# EAGLE design bue_steuerung_3 (EAGLE 7.6.0)
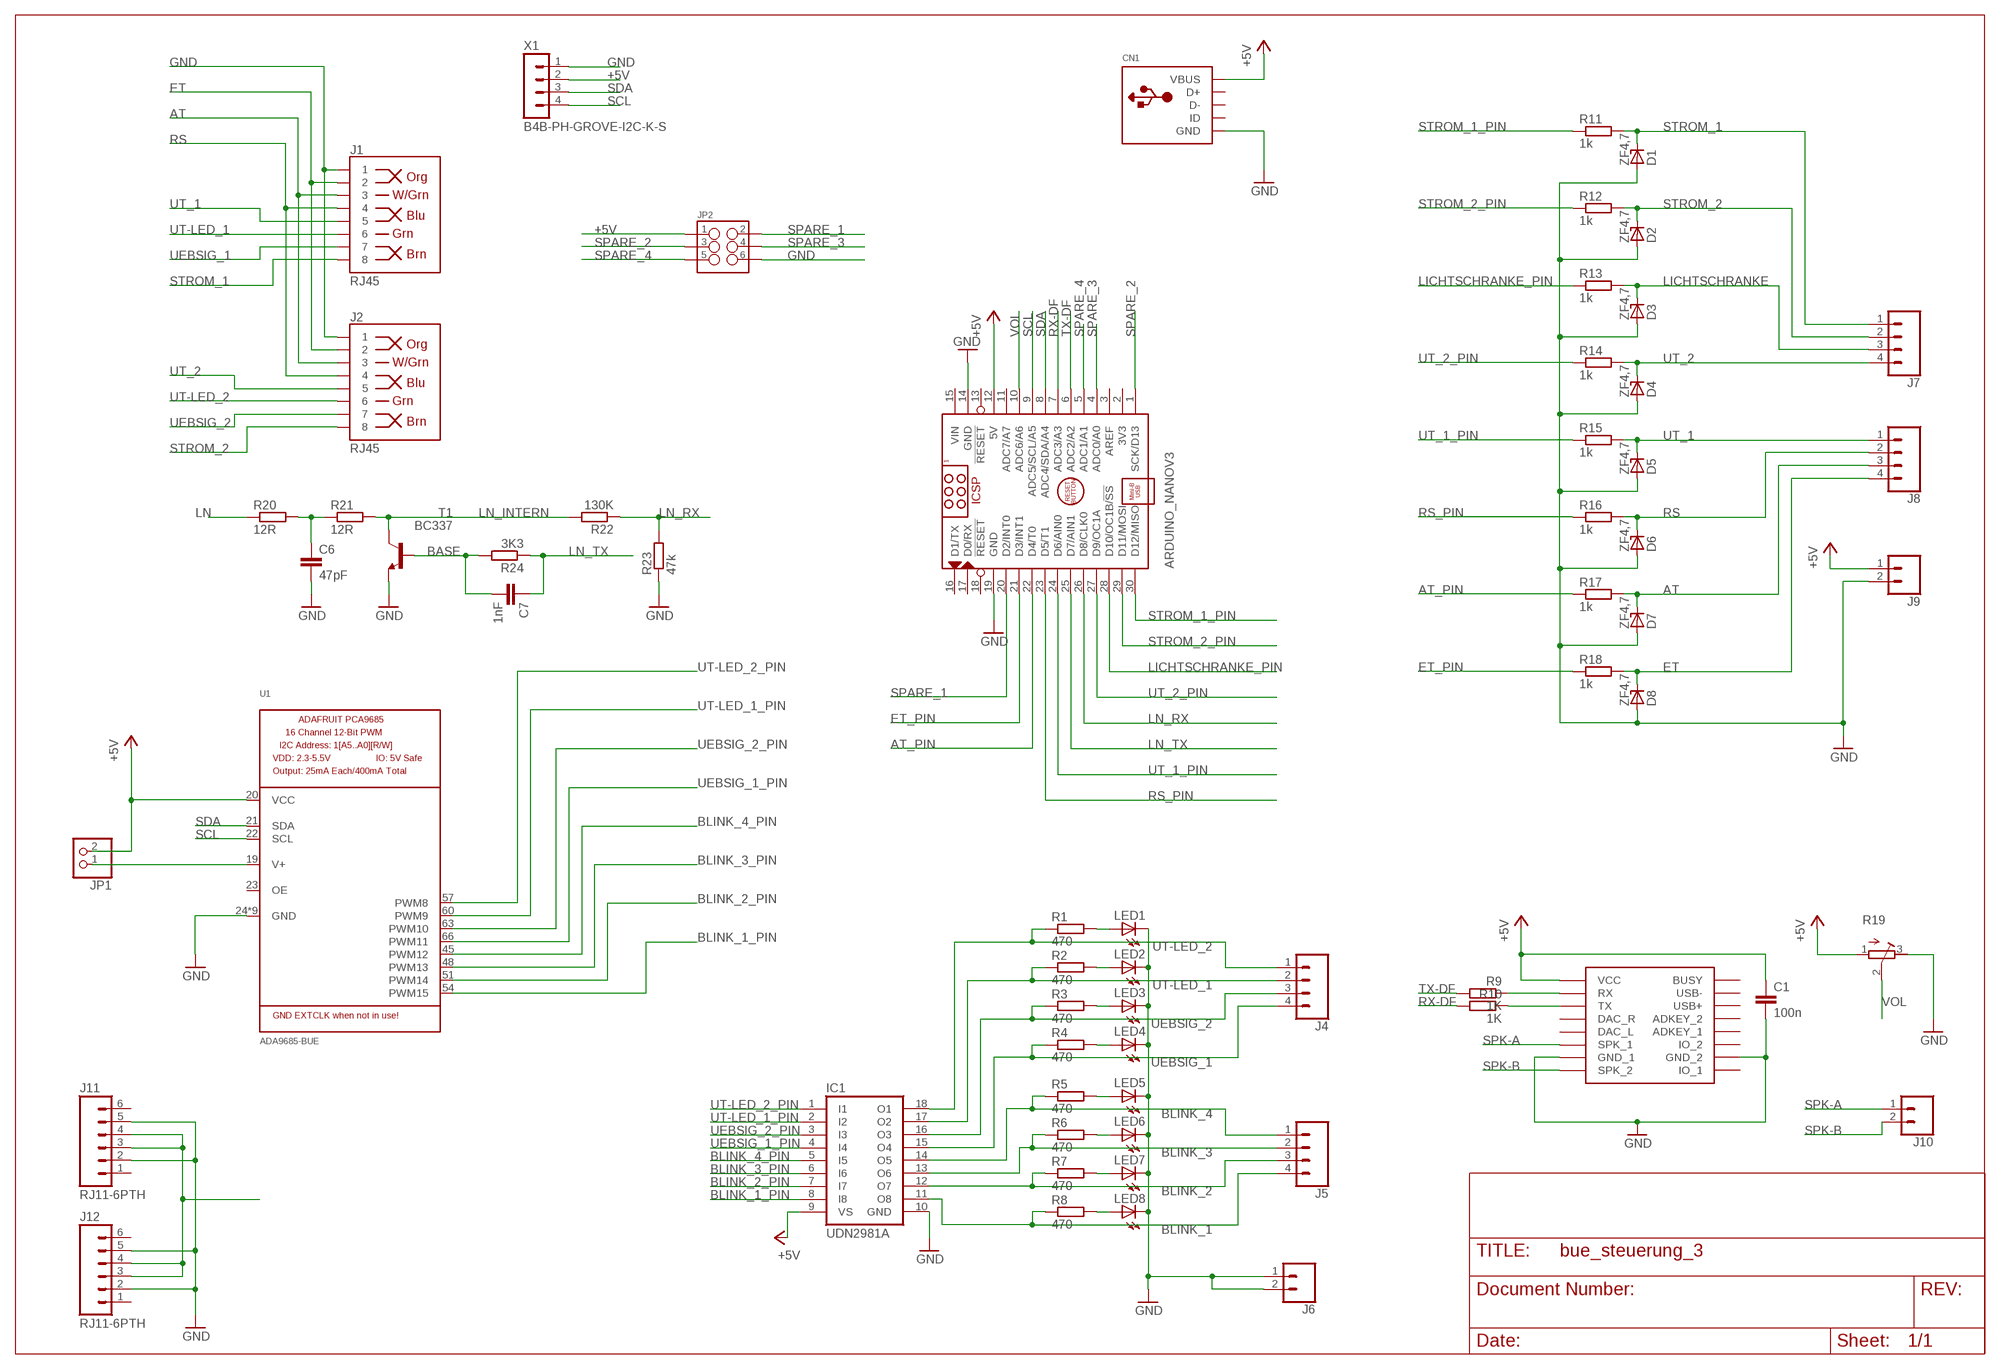
[diagram p0: schematic, sheet 1]

## Parts
ARDUINO_NANOV3  ARDUINO_NANO  [ARDUINO_NANO]
C1  100n  C-EUC0805  [C0805]
C6  47pF  C-EU025-024X044  [C025-024X044]
C7  1nF  C-EU025-025X050  [C025-025X050]
CN1  USBMOLEX  [USB-MINIB-THM-MOLEX]
D1  ZF4,7  ZENER-DIODEZD-7.5  [ZDIO-7.5]
D2  ZF4,7  ZENER-DIODEZD-7.5  [ZDIO-7.5]
D3  ZF4,7  ZENER-DIODEZD-7.5  [ZDIO-7.5]
D4  ZF4,7  ZENER-DIODEZD-7.5  [ZDIO-7.5]
D5  ZF4,7  ZENER-DIODEZD-7.5  [ZDIO-7.5]
D6  ZF4,7  ZENER-DIODEZD-7.5  [ZDIO-7.5]
D7  ZF4,7  ZENER-DIODEZD-7.5  [ZDIO-7.5]
D8  ZF4,7  ZENER-DIODEZD-7.5  [ZDIO-7.5]
IC1  UDN2981A  [DIL18]
J1  RJ45  RJ45-8  [RJ45-8]
J2  RJ45  RJ45-8  [RJ45-8]
J4  CONN_04SCREW  [SCREWTERMINAL-3.5MM-4]
J5  CONN_04SCREW  [SCREWTERMINAL-3.5MM-4]
J6  CONN_023.5MM  [SCREWTERMINAL-3.5MM-2]
J7  CONN_04SCREW  [SCREWTERMINAL-3.5MM-4]
J8  CONN_04SCREW  [SCREWTERMINAL-3.5MM-4]
J9  CONN_023.5MM  [SCREWTERMINAL-3.5MM-2]
J10  CONN_023.5MM  [SCREWTERMINAL-3.5MM-2]
J11  RJ11-6PTH  [RJ11-6]
J12  RJ11-6PTH  [RJ11-6]
JP1  PINHD-1X2  [1X02]
JP2  M03X2SHROUD  [2X3-SHROUDED]
LED1  LED3MM  [LED3MM]
LED2  LED3MM  [LED3MM]
LED3  LED3MM  [LED3MM]
LED4  LED3MM  [LED3MM]
LED5  LED3MM  [LED3MM]
LED6  LED3MM  [LED3MM]
LED7  LED3MM  [LED3MM]
LED8  LED3MM  [LED3MM]
R1  470  R-EU_0207/7  [0207/7]
R2  470  R-EU_0207/7  [0207/7]
R3  470  R-EU_0207/7  [0207/7]
R4  470  R-EU_0207/7  [0207/7]
R5  470  R-EU_0207/7  [0207/7]
R6  470  R-EU_0207/7  [0207/7]
R7  470  R-EU_0207/7  [0207/7]
R8  470  R-EU_0207/7  [0207/7]
R9  1K  R-EU_0207/7  [0207/7]
R10  1K  R-EU_0207/7  [0207/7]
R11  1k  R-EU_0207/7  [0207/7]
R12  1k  R-EU_0207/7  [0207/7]
R13  1k  R-EU_0207/7  [0207/7]
R14  1k  R-EU_0207/7  [0207/7]
R15  1k  R-EU_0207/7  [0207/7]
R16  1k  R-EU_0207/7  [0207/7]
R17  1k  R-EU_0207/7  [0207/7]
R18  1k  R-EU_0207/7  [0207/7]
R19  R-TRIMM64Y  [RTRIM64Y]
R20  12R  R-EU_0207/7  [0207/7]
R21  12R  R-EU_0207/7  [0207/7]
R22  130K  R-EU_0207/7  [0207/7]
R23  47k  R-EU_0207/7  [0207/7]
R24  3K3  R-EU_0207/7  [0207/7]
T1  BC337  [TO92]
U1  ADA9685-BUE  [ADA9685-BUE]
U2  DFPLAYER  [DFPLAYER]
X1  B4B-PH-GROVE-I2C-K-S  [B4B-PH-K-S]

## Nets
+5V: ARDUINO_NANOV3.12(5V) C1.1 CN1.VBUS IC1.9(VS) J9.1 JP1.2 JP2.1 R19.1(A) U1.20(VCC) U2.VCC X1.2
AT: D7.C J1.3 J2.3 J8.3 R17.2
AT_PIN: ARDUINO_NANOV3.22(D4/T0) R17.1
BASE: C7.2 R24.2 T1.2(B)
BLINK_1: IC1.11(O8) J5.4 R8.1
BLINK_1_PIN: IC1.8(I8) U1.54(PWM15)
BLINK_2: IC1.12(O7) J5.3 R7.1
BLINK_2_PIN: IC1.7(I7) U1.51(PWM14)
BLINK_3: IC1.13(O6) J5.2 R6.1
BLINK_3_PIN: IC1.6(I6) U1.48(PWM13)
BLINK_4: IC1.14(O5) J5.1 R5.1
BLINK_4_PIN: IC1.5(I5) U1.45(PWM12)
ET: D8.C J1.2 J2.2 J8.4 R18.2
ET_PIN: ARDUINO_NANOV3.21(D3/INT1) R18.1
GND: ARDUINO_NANOV3.14(GND) ARDUINO_NANOV3.19(GND) C1.2 C6.2 CN1.GND D1.A D2.A D3.A D4.A D5.A D6.A D7.A D8.A IC1.10(GND) J1.1 J2.1 J6.1 J6.2 J9.2 J11.2 J11.5 J12.2 J12.5 JP2.6 LED1.K(C) LED2.K(C) LED3.K(C) LED4.K(C) LED5.K(C) LED6.K(C) LED7.K(C) LED8.K(C) R19.3(E) R23.1 T1.1(E) U1.24(GND) U1.43(GND) U1.46(GND) U1.49(GND) U1.52(GND) U1.55(GND) U1.58(GND) U1.61(GND) U1.64(GND) U2.GND_1 U2.GND_2 X1.1
LICHTSCHRANKE: D3.C J7.3 R13.2
LICHTSCHRANKE_PIN: ARDUINO_NANOV3.28(D10/OC1B/!SS) R13.1
LN: J11.3 J11.4 J12.3 J12.4 R20.1
LN_INTERN: R21.2 R22.2 T1.3(C)
LN_RX: ARDUINO_NANOV3.26(D8/CLK0) R22.1 R23.2
LN_TX: ARDUINO_NANOV3.25(D7/AIN1) C7.1 R24.1
N$1: JP1.1 U1.19(V+)
N$6: LED4.A R4.2
N$7: C6.1 R20.2 R21.1
N$8: R9.1 U2.RX
N$10: R10.1 U2.TX
N$47: LED8.A R8.2
N$48: LED7.A R7.2
N$49: LED6.A R6.2
N$58: LED5.A R5.2
N$59: LED3.A R3.2
N$60: LED2.A R2.2
N$62: LED1.A R1.2
RS: D6.C J1.4 J2.4 J8.2 R16.2
RS_PIN: ARDUINO_NANOV3.23(D5/T1) R16.1
RX-DF: ARDUINO_NANOV3.7(ADC3/A3) R10.2
SCL: ARDUINO_NANOV3.9(ADC5/SCL/A5) U1.22(SCL) X1.4
SDA: ARDUINO_NANOV3.8(ADC4/SDA/A4) U1.21(SDA) X1.3
SPARE_1: ARDUINO_NANOV3.20(D2/INT0) JP2.2
SPARE_2: ARDUINO_NANOV3.1(SCK/D13) JP2.3
SPARE_3: ARDUINO_NANOV3.4(ADC0/A0) JP2.4
SPARE_4: ARDUINO_NANOV3.5(ADC1/A1) JP2.5
SPK-A: J10.1 U2.SPK1(SPK_1)
SPK-B: J10.2 U2.SPK2(SPK_2)
STROM_1: D1.C J1.8 J7.1 R11.2
STROM_1_PIN: ARDUINO_NANOV3.30(D12/MISO) R11.1
STROM_2: D2.C J2.8 J7.2 R12.2
STROM_2_PIN: ARDUINO_NANOV3.29(D11/MOSI) R12.1
TX-DF: ARDUINO_NANOV3.6(ADC2/A2) R9.2
UEBSIG_1: IC1.15(O4) J1.7 J4.4 R4.1
UEBSIG_1_PIN: IC1.4(I4) U1.66(PWM11)
UEBSIG_2: IC1.16(O3) J2.7 J4.3 R3.1
UEBSIG_2_PIN: IC1.3(I3) U1.63(PWM10)
UT-LED_1: IC1.17(O2) J1.6 J4.2 R2.1
UT-LED_1_PIN: IC1.2(I2) U1.60(PWM9)
UT-LED_2: IC1.18(O1) J2.6 J4.1 R1.1
UT-LED_2_PIN: IC1.1(I1) U1.57(PWM8)
UT_1: D5.C J1.5 J8.1 R15.2
UT_1_PIN: ARDUINO_NANOV3.24(D6/AIN0) R15.1
UT_2: D4.C J2.5 J7.4 R14.2
UT_2_PIN: ARDUINO_NANOV3.27(D9/OC1A) R14.1
VOL: ARDUINO_NANOV3.10(ADC6/A6) R19.2(S)
Unconnected: ARDUINO_NANOV3.2(3V3) ARDUINO_NANOV3.3(AREF) ARDUINO_NANOV3.11(ADC7/A7) ARDUINO_NANOV3.13(!RESET) ARDUINO_NANOV3.16(D1/TX) ARDUINO_NANOV3.17(D0/RX) ARDUINO_NANOV3.18(!RESET) CN1.D+ CN1.D- CN1.ID J11.1 J11.6 J12.1 J12.6 U1.23(OE) U2.ADKEY1(ADKEY_1) U2.ADKEY2(ADKEY_2) U2.BUSY U2.DAC_L U2.DAC_R U2.IO1(IO_1) U2.IO2(IO_2) U2.USB+ U2.USB-

## Power pins joined to a net without a drawn wire
VIN: ARDUINO_NANOV3.15(VIN)

## Library data of the parts
ARDUINO_NANOV3 = ArduinoNanoV30:ARDUINO_NANO: Arduino Nano V3.0 Module Overview: The Arduino Nano is a small, complete, and breadboard-friendly board based on the ATmega328 (Arduino Nano 3.x) or ATmega168 (Arduino Nano 2.x). It has more or less the same functionality of the Arduino Duemilanove, but in a different package. It lacks only a DC power jack, and works with a Mini-B USB cable instead of a standard one. The Nano was designed and is being produced by Gravitech <http://www.gravitech.us/arna30wiatp.html>. General specifications: Item Value Microcontroller Atmel ATmega168 or ATmega328 Operating Voltage (logic level) 5 V Input Voltage (recommended) 7-12 V Input Voltage (limits) 6-20 V Digital I/O Pins 14 (of which 6 provide PWM output) Analog Input Pins 8 DC Current per I/O Pin 40 mA Flash Memory 16 KB (ATmega168) or 32 KB (ATmega328) of which 2 KB used by bootloader SRAM 1 KB (ATmega168) or 2 KB (ATmega328) EEPROM 512 bytes (ATmega168) or 1 KB (ATmega328) Clock Speed 16 MHz Dimensions (Inches) 0.73" x 1.70" Dimensions (mm) 18mm x 45mm Overall height About 9 mm (not including pins) Weigth 5 g Power: The Arduino Nano can be powered via the Mini-B USB connection, 6-20V unregulated external power supply (pin 30), or 5V regulated external power supply (pin 27). The power source is automatically selected to the highest voltage source. Memory: The ATmega168 has 16 KB of flash memory for storing code (of which 2 KB is used for the bootloader); the ATmega328 has 32 KB, (also with 2 KB used for the bootloader). The ATmega168 has 1 KB of SRAM and 512 bytes of EEPROM (which can be read and written with the EEPROM library); the ATmega328 has 2 KB of SRAM and 1 KB of EEPROM. Input and Output: Each of the 14 digital pins on the Nano can be used as an input or output, using pinMode(), digitalWrite(), and digitalRead() functions. They operate at 5 volts. Each pin can provide or receive a maximum of 40 mA and has an internal pull-up resistor (disconnected by default) of 20-50 kOhms. In addition, some pins have specialized functions. Visit Arduino - ArduinoBoardNano <https://www.arduino.cc/en/Main/ArduinoBoardNano>
C1 C6 C7 = resistor:C-EU: CAPACITOR, European symbol
CN1 = adafruit:USB: USB Connectors USBMINIB - Surface Mount Female Mini-B USB Connector 4UConnector: 06564 By microbuilder.eu Thru-hole RA Female Mini-B USB Connector 4UConnector: 18732 By ladyada.net
D1-D8 = diode:ZENER-DIODE: Z-Diode
IC1 = uln-udn:UDN298*: DRIVER ARRAY Source: Allegro Microsystems Inc. / UDN2981-UDN2984.pdf
J1 J2 = SparkFun-Connectors:RJ45-8: RJ45 Jack - 8 pin Simple RJ45, 8-pin connection. Commonly used for Cat5, Cat5e, and Cat6 Ethernet cables. Here is the connector we sell at SparkFun: RJ45 8-Pin Connector <https://www.sparkfun.com/products/643> (PRT-00643) Datasheet <https://cdn.sparkfun.com/datasheets/Prototyping/04908.pdf> It is used on this SparkFun product: SparkFun RJ45 Breakout <https://www.sparkfun.com/products/716> (BOB-00716) Note, you may also be interested in the "MAGJACK" version of this. It is basically a RJ45 connector, but also has some status LEDs built into the connector housing. You can check that out in this library at the device named "MAGJACK.dev" and see these products online: RJ45 Ethernet MagJack-Compatible <https://www.sparkfun.com/products/8534> (PRT-08534) SparkFun RJ45 MagJack Breakout <https://www.sparkfun.com/products/13021> (BOB-13021); PROD_ID: CONN-08506; SF_ID: PRT-00643
J4 J5 J7 J8 = SparkFun-Connectors:CONN_04: Multi connection point. Often used as Generic Header-pin footprint for 0.1 inch spaced/style header connections On any of the 0.1 inch spaced packages, you can populate with these: Break Away Headers - Straight <https://www.sparkfun.com/products/116> (PRT-00116) Break Away Male Headers - Right Angle <https://www.sparkfun.com/products/553> (PRT-00553) Female Headers <https://www.sparkfun.com/products/115> (PRT-00115) Break Away Headers - Machine Pin <https://www.sparkfun.com/products/117> (PRT-00117) Break Away Female Headers - Swiss Machine Pin <https://www.sparkfun.com/products/743> (PRT-00743) For SCREWTERMINALS and SPRING TERMINALS visit here: Screw Terimnals on SparkFun.com <https://www.sparkfun.com/search/results?term=Screw+Terminals> (5mm/3.5mm/2.54mm spacing) This device is also useful as a general connection point to wire up your design to another part of your project. Our various solder wires solder well into these plated through hole pads. Hook-Up Wire - Assortment (Stranded, 22 AWG) <https://www.sparkfun.com/products/11375> (PRT-11375) Hook-Up Wire - Assortment (Solid Core, 22 AWG) <https://www.sparkfun.com/products/11367> (PRT-11367) View the entire wire category on our website here <https://www.sparkfun.com/categories/141> Special notes: Molex polarized connector foot print use with SKU : PRT-08231 with associated crimp pins and housings. 1MM SMD Version SKU: PRT-10208; PROD_ID: 2xCONN-08399; SF_ID: 2xPRT-08084
J6 J9 J10 = SparkFun-Connectors:CONN_02: Multi connection point. Often used as Generic Header-pin footprint for 0.1 inch spaced/style header connections On any of the 0.1 inch spaced packages, you can populate with these: Break Away Headers - Straight <https://www.sparkfun.com/products/116> (PRT-00116) Break Away Male Headers - Right Angle <https://www.sparkfun.com/products/553> (PRT-00553) Female Headers <https://www.sparkfun.com/products/115> (PRT-00115) Break Away Headers - Machine Pin <https://www.sparkfun.com/products/117> (PRT-00117) Break Away Female Headers - Swiss Machine Pin <https://www.sparkfun.com/products/743> (PRT-00743) For SCREWTERMINALS and SPRING TERMINALS visit here: Screw Terimnals on SparkFun.com <https://www.sparkfun.com/search/results?term=Screw+Terminals> (5mm/3.5mm/2.54mm spacing) This device is also useful as a general connection point to wire up your design to another part of your project. Our various solder wires solder well into these plated through hole pads. Hook-Up Wire - Assortment (Stranded, 22 AWG) <https://www.sparkfun.com/products/11375> (PRT-11375) Hook-Up Wire - Assortment (Solid Core, 22 AWG) <https://www.sparkfun.com/products/11367> (PRT-11367) View the entire wire category on our website here <https://www.sparkfun.com/categories/141> Special notes: Molex polarized connector foot print use with: PRT-08233 with associated crimp pins and housings. 2.54_SCREWTERM for use with PRT-10571. 3.5mm Screw Terminal footprints for PRT-08084 5mm Screw Terminal footprints for use with PRT-08432; PROD_ID: CONN-08399
J11 J12 = SparkFun-Connectors:RJ11-6: RJ11 Jack Simple 6 pin RJ11 jack. Commonly found on CAT3 devices and Microchip programmers. SKU: PRT-00132
JP1 = pinhead:PINHD-1X2: PIN HEADER
JP2 = SparkFun-Connectors:M03X2: 2x3 .1" header. Shrouded, with keying- CONN-10681 SMT- CONN-11415 Pogo pins- HW-11044; PROD_ID: CONN-10681
LED1-LED8 = adafruit:LED: LED OSRAM: - CHIPLED LG R971, LG N971, LY N971, LG Q971, LY Q971, LO R971, LY R971 LH N974, LH R974 LS Q976, LO Q976, LY Q976 LO Q996 - Hyper CHIPLED LW Q18S LB Q993, LB Q99A, LB R99A - SideLED LS A670, LO A670, LY A670, LG A670, LP A670 LB A673, LV A673, LT A673, LW A673 LH A674 LY A675 LS A676, LA A676, LO A676, LY A676, LW A676 LS A679, LY A679, LG A679 - Hyper Micro SIDELED® LS Y876, LA Y876, LO Y876, LY Y876 LT Y87S - SmartLED LW L88C, LW L88S LB L89C, LB L89S, LG L890 LS L89K, LO L89K, LY L89K LS L896, LA L896, LO L896, LY L896 - TOPLED LS T670, LO T670, LY T670, LG T670, LP T670 LSG T670, LSP T670, LSY T670, LOP T670, LYG T670 LG T671, LOG T671, LSG T671 LB T673, LV T673, LT T673, LW T673 LH T674 LS T676, LA T676, LO T676, LY T676, LB T676, LH T676, LSB T676, LW T676 LB T67C, LV T67C, LT T67C, LS T67K, LO T67K, LY T67K, LW E67C LS E67B, LA E67B, LO E67B, LY E67B, LB E67C, LV E67C, LT E67C LW T67C LS T679, LY T679, LG T679 LS T770, LO T770, LY T770, LG T770, LP T770 LB T773, LV T773, LT T773, LW T773 LH T774 LS E675, LA E675, LY E675, LS T675 LS T776, LA T776, LO T776, LY T776, LB T776 LHGB T686 LT T68C, LB T68C - Hyper Mini TOPLED® LB M676 - Mini TOPLED Santana® LG M470 LS M47K, LO M47K, LY M47K Source: http://www.osram.convergy.de/
R1-R8 R11-R18 = resistor@1:R-EU_: RESISTOR, European symbol
R9 R10 R20-R24 = resistor:R-EU_: RESISTOR, European symbol
R19 = resistor@1:R-TRIMM: Trimm resistor
T1 = transistor:BC337: NPN TRANSISTOR
U1 = bue-parts:ADA9685-BUE
U2 = DFPlayer_v1:DFPLAYER
X1 = bue-parts:B4B-PH-GROVE-I2C: JST PH series header 2.00mm pitch disconnectable crimp style connectors, vertical (side entry type), 4 pins

## Board
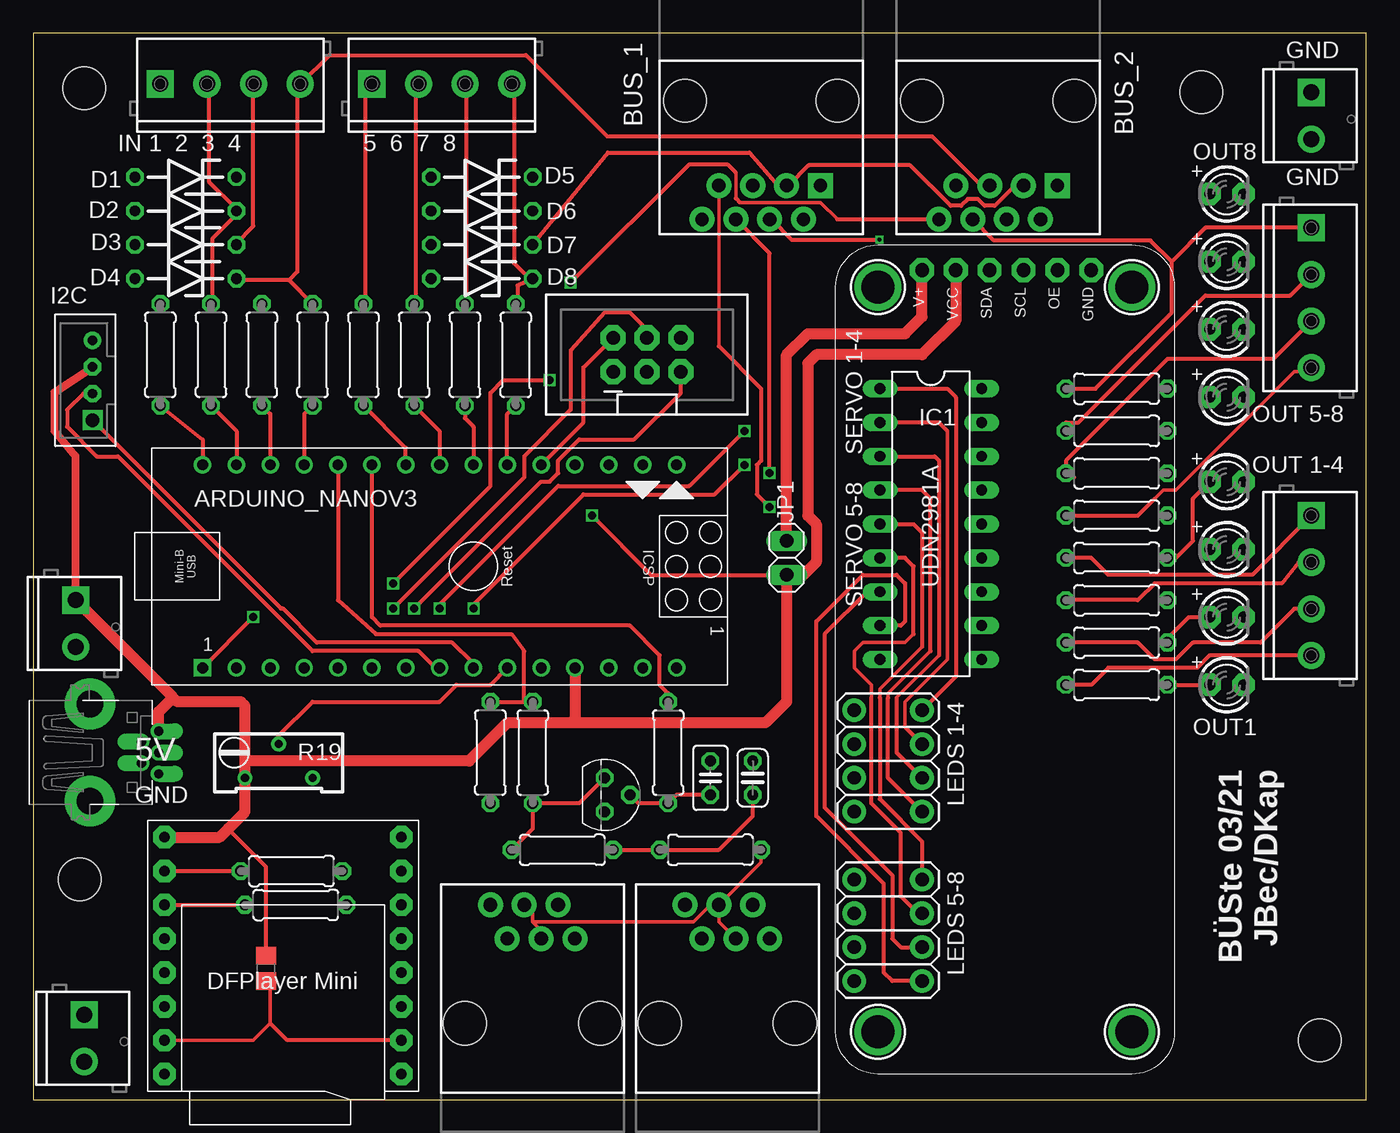
[diagram p1: board, top side]
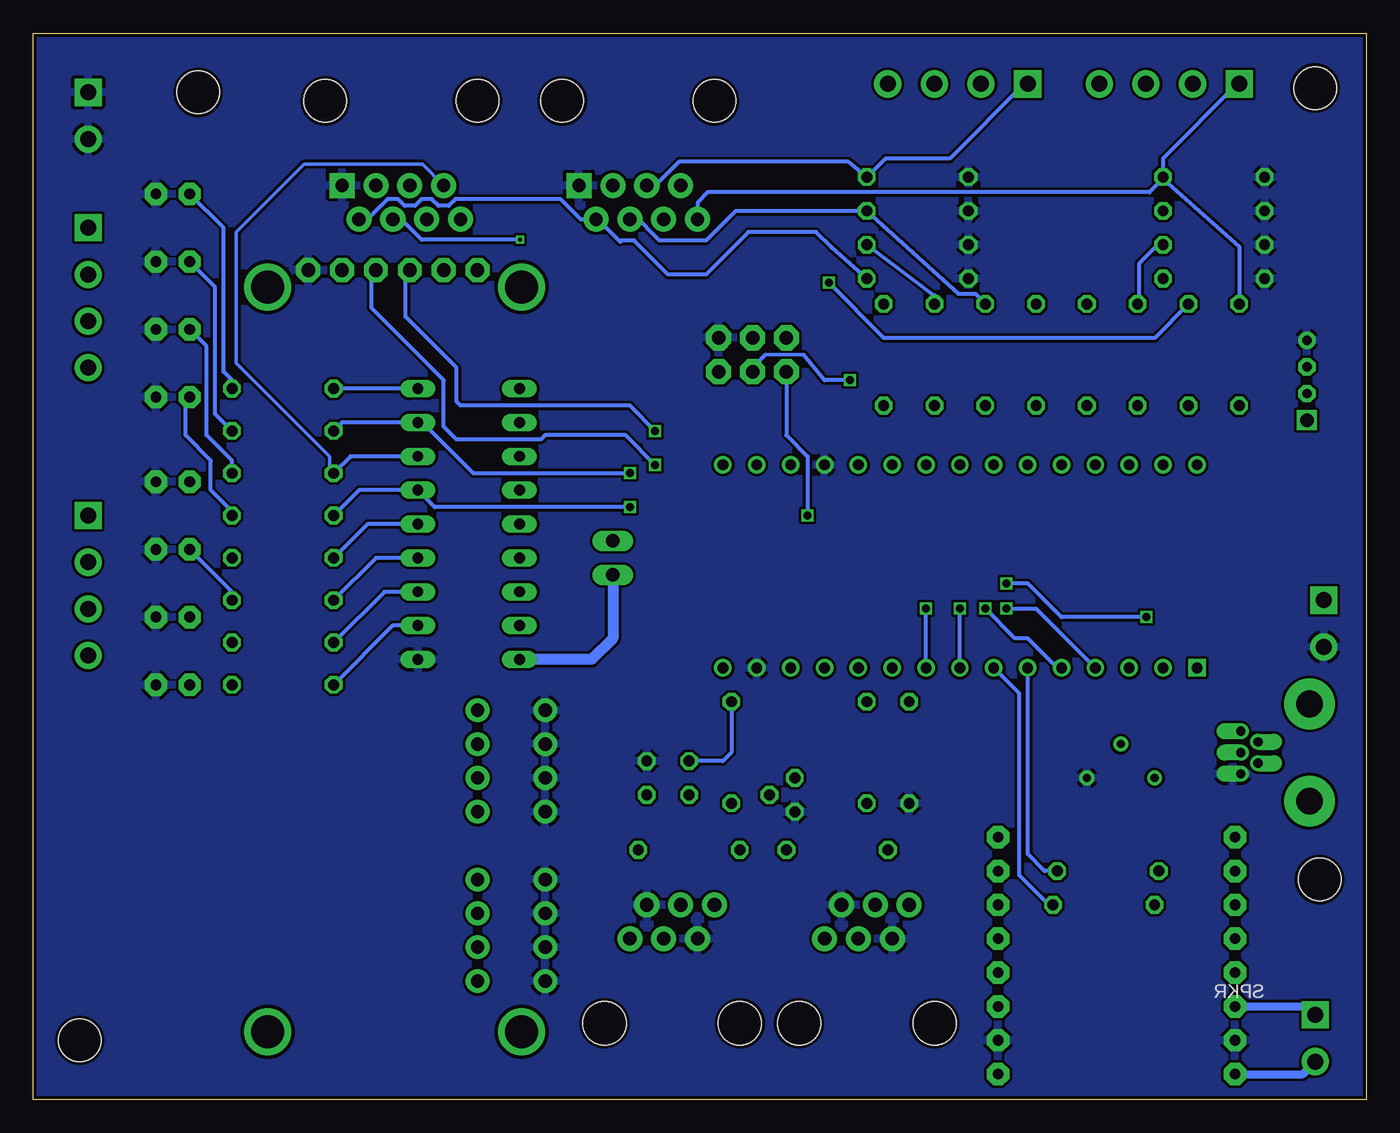
[diagram p2: board, bottom side, seen from below]

Size 100 x 80 mm. Coordinates in mm from the lower left corner, seen from the top.
Outline: 0,0 100,0 100,80 0,80 0,0
Copper layers (1*16): Top 0.035mm / dielectric 1.5mm / Bottom 0.035mm
Design rules "ITEADstudio_DRC_smaller_pad_restrings *": minimum track width 12mil, minimum drill 12mil, track to track 8mil, track to pad 8mil, pad to pad 8mil, via to via 8mil, smd to smd 0mil, copper to edge 10mil, drill to drill 10mil, minimum pad ring 10mil, minimum via ring 6mil, stop-mask expansion 2mil, vias tented up to drill 100mil, thermal gap 10mil
Holes 3.2 mm at 87.63,75.56 3.49,16.51 3.84,75.9 96.52,4.45

### Footprints (pad centres in the part's own frame; a part is rotated, then mirrored left to right if it is on the bottom)
ARDUINO_NANO = drill 0.8 square: 1 -20.32,-7.62 | drill 0.8: 2 -17.78,-7.62; 3 -15.24,-7.62; 4 -12.7,-7.62; 5 -10.16,-7.62; 6 -7.62,-7.62; 7 -5.08,-7.62; 8 -2.54,-7.62; 9 0,-7.62; 10 2.54,-7.62; 11 5.08,-7.62; 12 7.62,-7.62; 13 10.16,-7.62; 14 12.7,-7.62; 15 15.24,-7.62; 16 15.24,7.62; 17 12.7,7.62; 18 10.16,7.62; 19 7.62,7.62; 20 5.08,7.62; 21 2.54,7.62; 22 0,7.62; 23 -2.54,7.62; 24 -5.08,7.62; 25 -7.62,7.62; 26 -10.16,7.62; 27 -12.7,7.62; 28 -15.24,7.62; 29 -17.78,7.62; 30 -20.32,7.62
C0805 = smd 1.3 x 1.5: 1 -0.95,0; 2 0.95,0
C025-024X044 = drill 0.813 octagon: 1 -1.27,0; 2 1.27,0
C025-025X050 = drill 0.813 octagon: 1 -1.27,0; 2 1.27,0
USB-MINIB-THM-MOLEX = drill 0.7 offset: D+ 0,9.72; D- -0.8,8.42; GND 1.6,9.72; ID 0.8,8.42; VBUS -1.6,9.72 | drill 2 pad 3.81: GND1 -3.65,4.57; GND4 3.65,4.57
ZDIO-7.5 = drill 0.813 octagon: A 3.81,0; C -3.81,0
DIL18 = drill 0.813 long: 1 -10.16,-3.81; 2 -7.62,-3.81; 3 -5.08,-3.81; 4 -2.54,-3.81; 5 0,-3.81; 6 2.54,-3.81; 7 5.08,-3.81; 8 7.62,-3.81; 9 10.16,-3.81; 10 10.16,3.81; 11 7.62,3.81; 12 5.08,3.81; 13 2.54,3.81; 14 0,3.81; 15 -2.54,3.81; 16 -5.08,3.81; 17 -7.62,3.81; 18 -10.16,3.81
RJ45-8 = drill 1 pad 1.88 square: 1 -4.445,6.35 | drill 1 pad 1.88: 2 -3.175,8.89; 3 -1.905,6.35; 4 -0.635,8.89; 5 0.635,6.35; 6 1.905,8.89; 7 3.175,6.35; 8 4.445,8.89 | hole 3.2: -5.715,0; 5.715,0
SCREWTERMINAL-3.5MM-4 = drill 1.2 pad 2.032 square: 1 0,0 | drill 1.2 pad 2.032: 2 3.5,0; 3 7,0; 4 10.5,0
SCREWTERMINAL-3.5MM-2 = drill 1.2 pad 2.032 square: 1 0,0 | drill 1.2 pad 2.032: 2 3.5,0
RJ11-6 = drill 1.016 pad 1.88: 1 1.905,8.89; 2 3.175,6.35; 3 4.445,8.89; 4 5.715,6.35; 5 6.985,8.89; 6 8.255,6.35 | hole 3.251: 0,0; 10.16,0
1X02 = drill 1.016 long: 1 -1.27,0; 2 1.27,0
2X3-SHROUDED = drill 1.016 pad 1.88 octagon: 1 -1.27,2.54; 2 1.27,2.54; 3 -1.27,0; 4 1.27,0; 5 -1.27,-2.54; 6 1.27,-2.54
LED3MM = drill 0.813 pad 1.676 octagon: A -1.27,0; K 1.27,0
0207/7 = drill 0.813 octagon: 1 -3.81,0; 2 3.81,0
RTRIM64Y = drill 0.61: 1 0,-2.54; 2 -2.54,0; 3 0,2.54
TO92 = drill 0.813 octagon: 1 1.27,0; 2 0,1.905; 3 -1.27,0
ADA9685-BUE = drill 1.016 pad 1.778 octagon: 19 0,0; 20 0,2.54; 21 0,5.08; 22 0,7.62; 23 0,10.16; 24 0,12.7 | drill 1 pad 1.778: 43 45.72,-5.08; 45 45.72,0; 46 48.26,-5.08; 48 48.26,0; 49 50.8,-5.08; 51 50.8,0; 52 53.34,-5.08; 54 53.34,0; 55 33.02,-5.08; 57 33.02,0; 58 35.56,-5.08; 60 35.56,0; 61 38.1,-5.08; 63 38.1,0; 64 40.64,-5.08; 66 40.64,0 | drill 2.5 pad 3.2: P$1 1.27,-3.302; P$2 1.27,15.748; P$3 57.15,-3.302; P$4 57.15,15.748
DFPLAYER = drill 0.8 pad 1.676 octagon: ADKEY1 8.89,-1.27; ADKEY2 8.89,1.27; BUSY 8.89,8.89; DAC_L -8.89,-1.27; DAC_R -8.89,1.27; GND_1 -8.89,-6.35; GND_2 8.89,-6.35; IO1 8.89,-8.89; IO2 8.89,-3.81; RX -8.89,6.35; SPK1 -8.89,-3.81; SPK2 -8.89,-8.89; TX -8.89,3.81; USB+ 8.89,3.81; USB- 8.89,6.35; VCC -8.89,8.89
B4B-PH-K-S = drill 0.7 pad 1.3: 1 3,0 | drill 0.7 pad 1.3 octagon: 2 1,0; 3 -1,0 | drill 1 pad 1.3 square: 4 -3,0

### Placement (x,y rotation side)
ARDUINO_NANOV3  33.02,40.01 0 top
C1  17.46,9.84 270 top
C6  53.98,24.13 90 top
C7  50.8,24.13 270 top
CN1  -0.32,26.04 270 top
D1  11.43,69.22 180 top
D2  11.43,66.67 180 top
D3  11.43,64.14 180 top
D4  11.43,61.59 180 top
D5  33.66,69.22 180 top
D6  33.66,66.67 180 top
D7  33.66,64.14 180 top
D8  33.66,61.59 180 top
IC1  67.34,43.18 270 top
J1  54.61,74.93 180 top
J2  72.39,74.93 180 top
J4  95.89,65.41 270 top
J5  95.89,43.81 270 top
J6  95.89,75.56 270 top
J7  9.53,76.2 0 top
J8  25.4,76.2 0 top
J9  3.17,37.47 270 top
J10  3.81,6.35 270 top
J11  46.99,5.71 0 top
J12  32.38,5.71 0 top
JP1  56.52,40.64 270 top
JP2  46.04,55.88 90 top
LED1  89.53,67.94 0 top
LED2  89.53,62.87 0 top
LED3  89.53,57.78 0 top
LED4  89.53,52.7 0 top
LED5  89.53,46.35 0 top
LED6  89.53,41.27 0 top
LED7  89.53,36.2 0 top
LED8  89.53,31.11 0 top
R1  81.28,53.34 0 top
R2  81.28,50.16 0 top
R3  81.28,46.99 0 top
R4  81.28,43.81 0 top
R5  81.28,40.64 0 top
R6  81.28,37.47 0 top
R7  81.28,34.29 0 top
R8  81.28,31.11 0 top
R9  19.37,17.14 0 top
R10  19.68,14.61 0 top
R11  9.53,55.88 90 top
R12  13.34,55.88 90 top
R13  17.14,55.88 90 top
R14  20.95,55.88 90 top
R15  24.77,55.88 90 top
R16  28.57,55.88 90 top
R17  32.38,55.88 90 top
R18  36.2,55.88 90 top
R19  18.41,24.13 270 top
R20  50.8,18.73 180 top
R21  39.69,18.73 180 top
R22  37.47,26.04 270 top
R23  34.29,26.04 90 top
R24  47.62,26.04 270 top
T1  42.86,22.86 270 top
U1  66.67,62.23 270 top
U2  18.73,10.79 0 top
X1  4.45,53.98 90 top

### Tracks (layer width: path | path; a pad name or v marks a point on that pad's centre or on a via)
+5V  (via drill 0.6)
  Top 0.305: C1.1 17.46,17.46 14.61,20.32 | v41.91,43.81 46.35,39.37 JP1.2
  Top 0.61: J9.1 3.17,48.26 1.59,50.16 1.59,53.07 X1.2
  Top 0.813: 10.48,30.16 10.79,29.84 15.56,29.84 15.88,29.53 15.88,25.4 | 10.48,30.16 J9.1 | CN1.VBUS 9.4,29.09 10.48,30.16 | U1.20 69.22,58.42 66.67,55.88 58.74,55.88 58.1,55.24 58.1,43.81 58.74,43.18 58.74,40.32 57.78,39.37 JP1.2 56.52,29.84 54.93,28.26 40.32,28.26 | U2.VCC 13.97,19.68 14.61,20.32 15.88,21.59 R19.1 15.88,25.4 | ARDUINO_NANOV3.12 40.64,28.57 40.32,28.26 | 40.32,28.26 35.56,28.26 32.7,25.4 15.88,25.4
  Bottom 0.305: JP2.1 43.5,49.85 41.91,48.26 v41.91,43.81
  Bottom 0.813: JP1.2 56.52,34.61 58.1,33.02 IC1.9
AT
  Top 0.305: R17.2 32.51,59.82 32.51,76.2 J8.3 | D7.C 43.12,71.06 53.72,71.06 55.88,68.58 J1.3 56.64,68.58 58.17,70.1 65.79,70.1 68.83,67.06 69.6,67.06 70.1,67.56 70.87,67.56 71.37,67.06 72.14,67.06 73.66,68.58 J2.3
  Bottom 0.305: D7.C 32.38,60.33 R17.2
AT_PIN
  Top 0.305: R17.1 32.38,51.12 33.02,50.48 ARDUINO_NANOV3.22
BASE
  Top 0.305: T1.2 45.4,22.23 R24.2 48.26,22.86 C7.2
BLINK_1
  Top 0.305: J5.4 88.24,33.31 87.31,32.38 80.64,32.38 79.38,31.11 R8.1
  Bottom 0.305: IC1.11 73.03,35.56 R8.1
BLINK_1_PIN
  Top 0.305: U1.54 64.45,8.89 63.82,9.53 63.82,16.19 58.74,21.27 58.74,35.88 62.23,39.37 64.77,39.37 65.41,38.73 65.41,35.88 65.09,35.56 IC1.8
BLINK_2
  Top 0.305: J5.3 94.6,36.81 92.08,34.29 87,34.29 85.72,33.02 84.14,33.02 82.87,34.29 R7.1
  Bottom 0.305: IC1.12 73.66,38.1 R7.1
BLINK_2_PIN
  Top 0.305: IC1.7 62.55,38.1 59.37,34.92 59.37,21.91 64.45,16.83 64.45,12.06 65.09,11.43 U1.51
BLINK_3
  Top 0.305: J5.2 94.92,40.31 93.66,38.73 84.14,38.73 82.87,37.47 R6.1
  Bottom 0.305: IC1.13 74.3,40.64 R6.1
BLINK_3_PIN
  Top 0.254: 62.87,30.16 62.87,31.11 61.59,32.38 61.59,33.66 62.23,34.29 65.41,34.29 66.04,34.92
  Top 0.305: 66.04,34.92 66.04,40.01 65.41,40.64 IC1.6 | U1.48 66.36,13.97 65.09,15.24 65.09,20 62.87,22.23 62.87,30.16
BLINK_4
  Top 0.305: J5.1 91.44,39.37 80.64,39.37 79.38,40.64 R5.1
  Bottom 0.305: IC1.14 74.93,43.18 R5.1
BLINK_4_PIN
  Top 0.254: 63.5,30.16 63.5,30.8 66.67,33.97
  Top 0.305: IC1.5 66.04,43.18 66.67,42.55 66.67,33.97 | 63.5,30.16 63.5,22.54 66.67,19.37 U1.45
ET
  Top 0.305: R18.2 36.32,59.82 36.32,61.09 D8.C 37.34,61.72 37.34,61.47 36.07,62.74 36.07,76.2 J8.4
  Bottom 0.305: D8.C 40.13,63.94 41.27,65.09 46.35,65.09 49.53,61.91 52.39,61.91 54.93,64.45 55.88,64.45 55.98,64.36 57.66,66.04 J1.2 58.93,66.04 60.45,67.56 68.33,67.56 68.83,67.06 69.6,67.06 70.1,67.56 70.87,67.56 71.37,67.06 72.14,67.06 72.64,67.56 73.41,67.56 74.93,66.04 J2.2
ET_PIN
  Top 0.305: ARDUINO_NANOV3.21 35.56,51.44 R18.1
GND
  Top 0.254: U2.GND_1 16.51,4.45 17.78,5.71 17.78,8.57 C1.2
  Top 0.305: U2.GND_2 19.05,4.45 17.78,5.71
  pour Bottom: 0,80.01 100.33,80.01 100.33,0 0,0
LICHTSCHRANKE
  Top 0.305: D3.C 15.24,64.26 16.51,65.53 J7.3
  Bottom 0.305: D3.C 15.24,64.52 17.02,62.74 17.02,59.69 R13.2
LICHTSCHRANKE_PIN
  Top 0.305: ARDUINO_NANOV3.28 17.78,51.44 R13.1
LN
  Top 0.254: R20.1 54.61,17.78 J11.3 | J11.3 51.44,13.34 J11.4 | J11.3 50.8,14.61 49.53,13.34 37.47,13.34 | 37.47,13.34 37.47,13.97 J12.3 | J12.4 38.1,12.7 37.47,13.34
LN_INTERN
  Top 0.305: T1.3 40.96,22.23 R22.2 37.47,20.32 R21.2
LN_RX
  Top 0.305: R22.1 36.83,29.84 | R23.2 36.83,29.84 | 36.83,29.84 36.83,33.66 35.88,34.92 25.72,34.92 22.86,37.47 ARDUINO_NANOV3.26
LN_TX
  Top 0.305: R24.1 47.62,30.48 46.99,31.11 46.99,33.34 44.77,35.56 26.04,35.56 25.4,36.2 ARDUINO_NANOV3.25
  Bottom 0.305: R24.1 47.62,26.04 48.26,25.4 C7.1
N$1
  Top 0.813: JP1.1 56.52,55.88 58.1,57.47 65.41,57.47 66.67,58.74 U1.19
N$6
  Bottom 0.305: R4.2 85.09,44.13 86.68,45.72 86.68,47.94 88.58,49.85 88.58,52.39 LED4.A
N$7
  Top 0.305: R21.1 R20.2 51.44,18.73 53.98,21.27 C6.1
N$8
  Top 0.305: U2.RX R9.1
N$10
  Top 0.305: U2.TX R10.1
N$47
  Top 0.305: R8.2 LED8.A
N$48
  Top 0.305: R7.2 85.09,34.61 86.68,36.2 LED7.A
N$49
  Bottom 0.305: R6.2 85.09,38.1 LED6.A
N$58
  Top 0.305: R5.2 85.72,40.64 87,41.91 87,45.09 LED5.A
N$59
  Bottom 0.305: R3.2 85.09,47.94 87,49.85 87,56.52 LED3.A
N$60
  Bottom 0.305: R2.2 86.36,51.44 86.36,60.96 LED2.A
N$62
  Bottom 0.305: R1.2 85.09,53.98 85.72,54.61 85.72,65.41 LED1.A
RS  (via drill 0.3)
  Top 0.305: R16.2 28.7,59.82 28.7,76.2 J8.2 | v63.48,64.52 56.9,64.52 55.37,66.04 J1.4
  Bottom 0.305: R16.2 29.34,60.45 30.61,60.45 D6.C 47.31,66.67 49.53,64.45 53.02,64.45 53.09,64.52 53.34,64.77 54.61,66.04 J1.4 | v63.48,64.52 70.87,64.52 72.39,66.04 J2.4
RS_PIN
  Top 0.305: R16.1 30.48,50.16 ARDUINO_NANOV3.23
RX-DF
  Bottom 0.305: R10.2 23.81,14.61 26.04,16.83 26.04,30.48 ARDUINO_NANOV3.7
SCL  (via drill 0.6)
  Top 0.305: ARDUINO_NANOV3.9 33.02,32.7 31.43,34.29 21.27,34.29 18.73,36.83 18.59,36.83 X1.4 | v33.02,36.83 33.02,37.15 41.27,45.4 51.12,45.4 v53.34,47.62
  Bottom 0.305: ARDUINO_NANOV3.9 v33.02,36.83 | U1.22 74.61,61.91 74.61,59.37 69.22,53.98 69.22,50.48 68.26,49.53 61.91,49.53 61.59,49.85 55.56,49.85 v53.34,47.62
SDA  (via drill 0.6)
  Top 0.305: ARDUINO_NANOV3.8 30.16,32.38 28.89,33.66 20.95,33.66 6.35,48.26 4.76,48.26 2.54,50.48 2.54,51.75 3.76,52.98 X1.3 | v30.48,36.83 30.48,37.15 39.37,46.04 49.21,46.04 v53.34,50.16
  Bottom 0.305: ARDUINO_NANOV3.8 v30.48,36.83 | U1.21 72.07,61.91 72.07,58.74 68.26,54.93 68.26,52.39 67.94,52.07 55.24,52.07 v53.34,50.16
SPARE_1
  Top 0.305: ARDUINO_NANOV3.20 41.27,50.8 41.27,54.93 JP2.2
SPARE_2  (via drill 0.6)
  Top 0.305: ARDUINO_NANOV3.1 v16.51,36.2 | v26.99,38.73 34.29,46.04 34.29,53.02 35.24,53.98 v38.73,53.98
  Bottom 0.254: 42.23,55.88 45.09,55.88
  Bottom 0.305: v38.73,53.98 40.64,53.98 42.23,55.88 | 45.09,55.88 45.72,55.24 JP2.3 | v16.51,36.2 22.86,36.2 25.4,38.73 v26.99,38.73
SPARE_3  (via drill 0.6)
  Top 0.305: JP2.4 46.04,57.78 44.77,59.05 42.86,59.05 40.32,56.2 40.32,51.75 36.83,48.26 36.83,46.67 v26.99,36.83
  Bottom 0.305: v26.99,36.83 24.77,36.83 ARDUINO_NANOV3.4
SPARE_4  (via drill 0.6)
  Top 0.305: v28.57,36.83 38.1,46.35 38.73,46.35 39.37,46.99 39.37,47.94 40.96,49.53 45.09,49.53 48.58,53.02 JP2.5
  Bottom 0.305: ARDUINO_NANOV3.5 23.18,32.38 25.4,34.61 26.35,34.61 v28.57,36.83
SPK-A
  Bottom 0.61: U2.SPK1 4.45,6.99 J10.1
SPK-B
  Bottom 0.61: U2.SPK2 4.75,1.91 J10.2
STROM_1
  Bottom 0.305: R11.2 9.53,64.01 15.24,69.09 | 15.24,69.09 16.26,68.07 49.4,68.07 50.16,67.31 J1.8 | 15.24,69.09 D1.C 15.24,70.61 9.65,76.2 J7.1
STROM_1_PIN
  Top 0.305: ARDUINO_NANOV3.30 12.7,49.53 R11.1
STROM_2  (via drill 0.6)
  Top 0.254: 52.7,69.53 52.7,67.63 | 53.02,67.31 59.05,67.31 60.33,66.04
  Top 0.305: R12.2 13.46,59.69 13.46,64.64 15.24,66.42 D2.C 15.24,66.8 13.21,68.83 13.21,76.2 J7.2 | v40.32,61.28 49.21,70.17 52.07,70.17 52.7,69.53 | 52.7,67.63 53.02,67.31 | 60.33,66.04 J2.8
  Bottom 0.305: R12.2 15.88,57.15 36.2,57.15 v40.32,61.28
STROM_2_PIN
  Top 0.305: ARDUINO_NANOV3.29 15.24,50.16 R12.1
TX-DF
  Bottom 0.305: R9.2 24.13,17.14 25.4,18.41 ARDUINO_NANOV3.6
UEBSIG_1  (via drill 0.6)
  Top 0.254: J1.7 51.44,56.52 | 84.14,45.09 84.77,45.72 85.72,45.72 94.61,54.61 95.59,54.61 J4.4
  Top 0.305: R4.1 82.87,43.81 84.14,45.09 | 95.86,54.93 J4.4 | 51.44,56.52 54.61,53.34 54.61,47.94 54.29,47.62 54.29,45.4 v55.24,44.45
  Bottom 0.305: R4.1 75.56,45.72 IC1.15 69.88,44.45 v55.24,44.45
UEBSIG_1_PIN
  Top 0.254: 64.14,30.16 64.14,30.48 67.31,33.66
  Top 0.305: U1.66 64.14,24.13 64.14,30.16 | 67.31,33.66 67.31,45.09 66.67,45.72 IC1.4
UEBSIG_2
  Top 0.305: 78.11,46.67 77.79,46.67 R3.1 77.47,47.94 85.09,55.56 93.03,55.56 95.87,58.41 J4.3
  Bottom 0.254: J2.7 70.8,70.17 79.69,70.17 84.77,65.09 84.77,55.24 77.79,48.26 77.79,47.31 R3.1
  Bottom 0.305: IC1.16 76.2,48.26 R3.1
UEBSIG_2_PIN
  Top 0.254: 64.77,30.16 67.94,33.34
  Top 0.305: IC1.3 67.63,48.26 67.94,47.94 67.94,33.34 | 64.77,30.16 64.77,26.04 U1.63
UT-LED_1  (via drill 0.6)
  Top 0.305: R2.1 77.47,50.8 78.42,50.8 87.95,60.33 94.31,60.33 J4.2 | v55.24,46.99 55.24,63.5 J1.6
  Bottom 0.305: R2.1 76.83,50.8 IC1.17 70.8,50.8 66.99,46.99 v55.24,46.99
UT-LED_1_PIN
  Top 0.254: 65.41,27.94 65.41,29.84 68.58,33.02 68.58,50.16
  Top 0.305: U1.60 65.41,27.94 | 68.58,50.16 67.94,50.8 IC1.2
UT-LED_2
  Top 0.305: R1.1 79.69,53.34 85.41,59.05 85.41,62.87 | 85.41,62.87 83.82,64.45 72.07,64.45 J2.6 | J4.1 87.95,65.41 85.41,62.87
  Bottom 0.305: IC1.18 R1.1
UT-LED_2_PIN
  Top 0.305: IC1.1 68.58,53.34 69.22,52.7 69.22,31.75 U1.57
UT_1
  Top 0.305: R15.2 24.89,59.82 24.89,75.69 J8.1
  Bottom 0.305: J8.1 25.65,76.2 31.24,70.61 36.07,70.61 D5.C 38.86,70.36 51.56,70.36 53.34,68.58 J1.5
UT_1_PIN
  Top 0.305: ARDUINO_NANOV3.24 27.94,48.9 R15.1
UT_2
  Top 0.305: 19.18,61.47 15.24,61.47 D4.C | 19.18,61.47 R14.2 | J2.5 71.12,68.58 67.44,72.26 43.05,72.26 36.96,78.36 22.23,78.36 20.07,76.2 J7.4 19.81,76.2 19.81,62.1 19.18,61.47
UT_2_PIN
  Top 0.305: ARDUINO_NANOV3.27 20.32,51.44 R14.1
VOL
  Top 0.305: 35.56,32.26 ARDUINO_NANOV3.10 34.29,31.11 31.75,31.11 30.48,29.84 20.95,29.84 18.41,27.3 R19.2

### Text on the board
tPlace: IN 1 2 3 4 | 5 6 7 8 | OUT8 | I2C | OUT 5-8 | OUT 1-4 | OUT1
bPlace: SPKR
tNames: GND | BUS_1 | BUS_2 | GND | UDN2981A | 5V | BÜSte 03/21 / JBec/DKap | GND